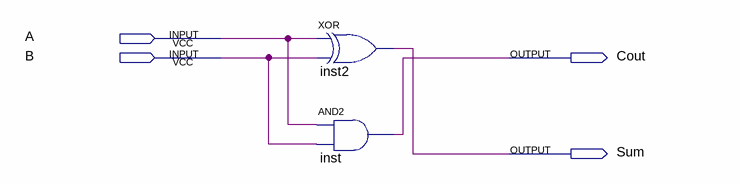
[diagram p0: schematic sheet]
// Quartus schematic HalfAdder.bdf as structural Verilog: 2 symbols, 4 pins
module HalfAdder (
  input  A,
  input  B,
  output Cout,
  output Sum
);

  xor inst2 (Sum, A, B);
  and inst (Cout, A, B);
endmodule
